# Altium schematic sheet SD.SchDoc: SD Breakout
size B; Engineer: Jacob Faucett; Organization: CUAir; Address1: L3, 12a Rodborough Rd; Address2: Frenchs Forest; Address3: NSW; Address4: Australia 2086; Revision: 1; SheetNumber: 4; SheetTotal: 9; CompetitionYear: 2025; CPN: N/A; PROJECT: Current Logging and Validation Board
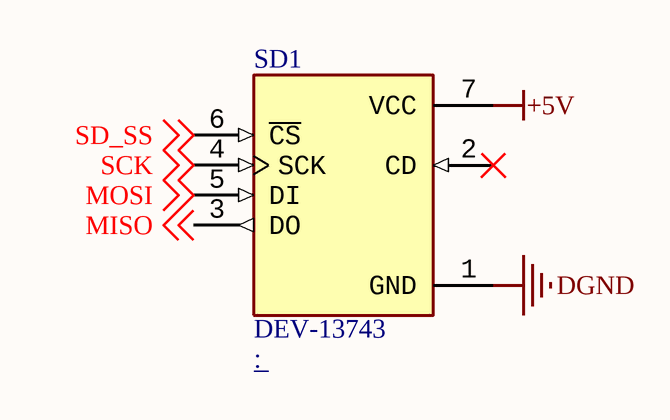
[diagram p0: SD.SchDoc]

## Parts
SD1  DEV-13743  [MODULE_DEV-13743]

## Nets
+5V: SD1.7(VCC)
DGND: SD1.1(GND)
MISO: SD1.3(DO) ; off-sheet MISO
MOSI: SD1.5(DI) ; off-sheet MOSI
SCK: SD1.4(SCK) ; off-sheet SCK
SD_SS: SD1.6(~{CS}) ; off-sheet SD_SS

Not connected (* = marked no-connect by the designer): SD1 2(CD)*

## Notes on the sheet
- Project
- Title
- Size:
- Date:
- B
- Number:
- Revision:
- File:

## Library data of the parts
SD1 = DEV-13743: SPARKFUN LEVEL SHIFTING MICROSD; MF: SparkFun Electronics; SnapEDA_Link: https://www.snapeda.com/parts/DEV-13743/SparkFun%20Electronics/view-part/567676/?ref=snap; Package: None; Price: None; MP: DEV-13743; Availability: Unavailable; Value: *